# Altium project eBug2014-Parallella-Carrier-V.PrjPcb
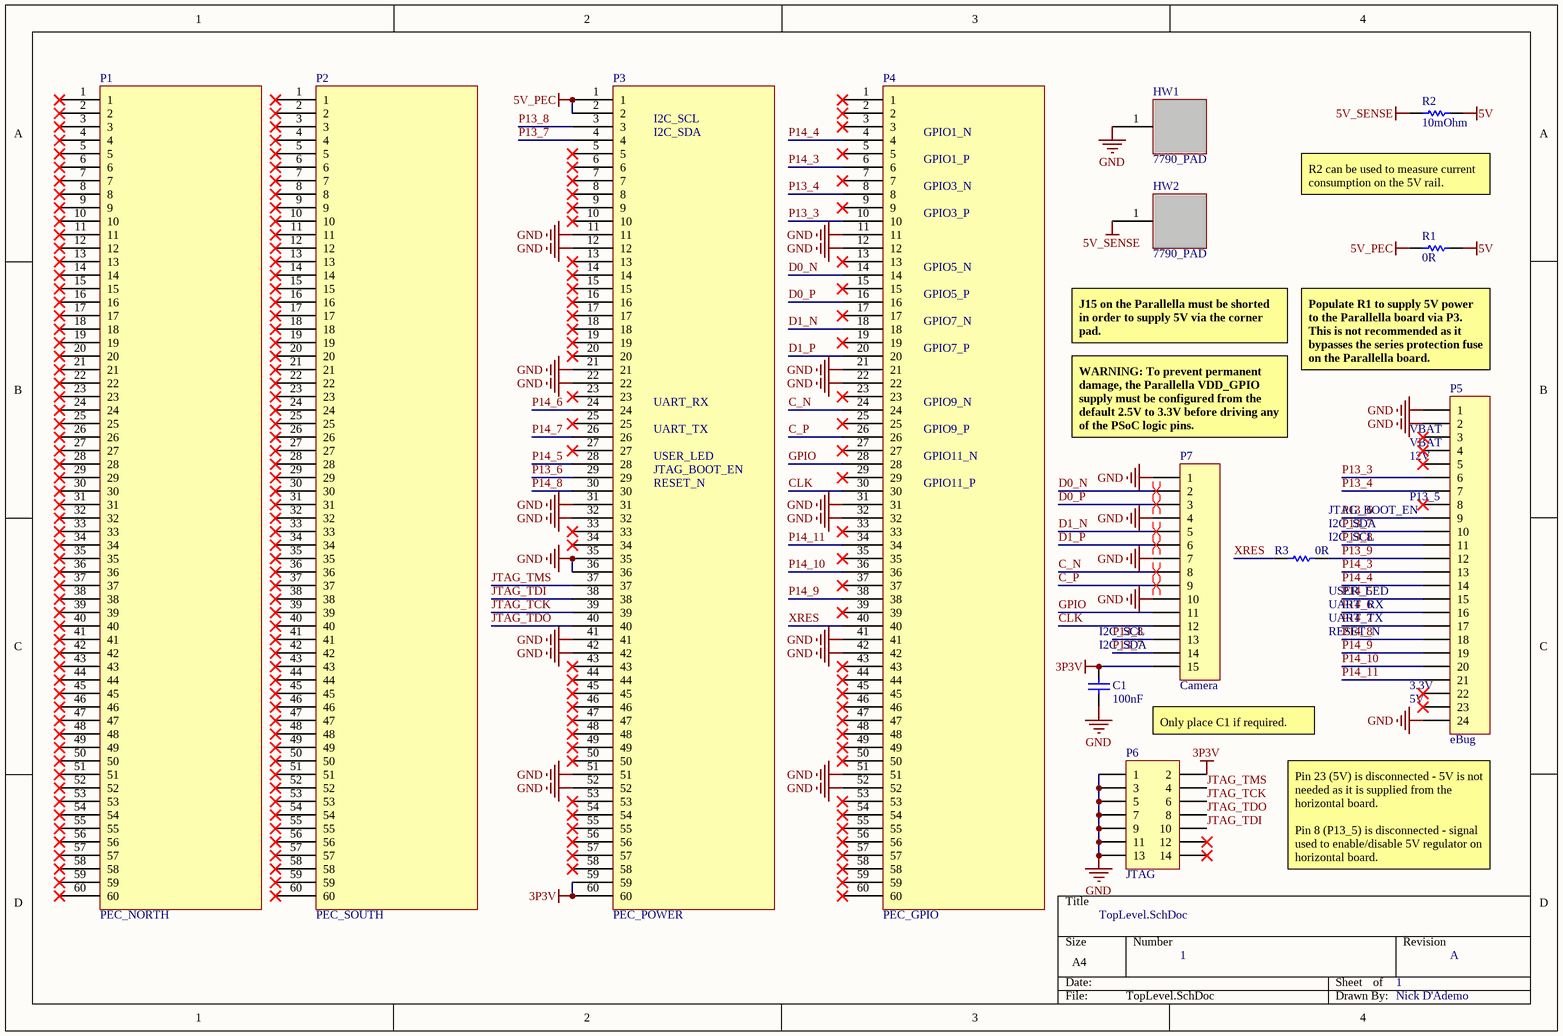
[diagram p0: TopLevel.SchDoc]
1 sheet, 13 parts. Net scope: global (net labels, ports and power ports of the same name join across sheets).
Board file: PCB.PcbDoc

## Sheet TopLevel.SchDoc
size A4; DrawnBy: Nick D'Ademo; DocumentNumber: 1; Revision: A; SheetNumber: 1; SheetTotal: 1

### Parts
C1  value 100nF  [CAPC1005N]  (hidden comment: Cap)
HW1  7790_PAD  [7790_PAD]  (no BOM)
HW2  7790_PAD  [7790_PAD]  (no BOM)
P1  PEC_NORTH  [BTH-030-01-F-D-A]
P2  PEC_SOUTH  [BTH-030-01-F-D-A]
P3  PEC_POWER  [BTH-030-01-F-D-A]
P4  PEC_GPIO  [BTH-030-01-F-D-A]
P5  eBug  [2-1734592-4_MIRRORED]
P6  JTAG  [2x7H_2mm]
P7  Camera  [1-1734248-5]
R1  value 0R  [RESC1608M]  (hidden comment: Jumper Resistor)
R2  value 10mOhm  [RESC6432M]  (hidden comment: Current Sense Resistor)
R3  value 0R  [RESC1608M]  (hidden comment: Jumper Resistor)

### Nets
3P3V: C1.2 P3.59 P3.60 P6.2 P7.15
5V: R1.1 R2.1
5V_PEC: P3.1 P3.2 R1.2
5V_SENSE: HW2.1 R2.2
GND: C1.1 HW1.1 P3.11 P3.12 P3.21 P3.22 P3.31 P3.32 P3.35 P3.36 P3.41 P3.42 P3.51 P3.52 P4.11 P4.12 P4.21 P4.22 P4.31 P4.32 P4.41 P4.42 P4.51 P4.52 P5.1 P5.2 P5.24 P6.1 P6.3 P6.5 P6.7 P6.9 P6.11 P6.13 P7.1 P7.4 P7.7 P7.10
C_N: P4.24 P7.8
C_P: P4.26 P7.9
CLK: P4.30 P7.12
D0_N: P4.14 P7.2
D0_P: P4.16 P7.3
D1_N: P4.18 P7.5
D1_P: P4.20 P7.6
GPIO: P4.28 P7.11
JTAG_TCK: P3.39 P6.6
JTAG_TDI: P3.38 P6.10
JTAG_TDO: P3.40 P6.8
JTAG_TMS: P3.37 P6.4
P13_3: P4.10 P5.6
P13_4: P4.8 P5.7
P13_6: P3.29 P5.9
P13_7: P3.4 P5.10 P7.14
P13_8: P3.3 P5.11 P7.13
P13_9: P5.12 R3.1
P14_3: P4.6 P5.13
P14_4: P4.4 P5.14
P14_5: P3.28 P5.15
P14_6: P3.24 P5.16
P14_7: P3.26 P5.17
P14_8: P3.30 P5.18
P14_9: P4.38 P5.19
P14_10: P4.36 P5.20
P14_11: P4.34 P5.21
XRES: P4.40 R3.2

Not connected (* = marked no-connect by the designer): P1 1* 2* 3* 4* 5* 6* 7* 8* 9* 10* 11* 12* 13* 14* 15* 16* 17* 18* 19* 20* 21* 22* 23* 24* 25* 26* 27* 28* 29* 30* 31* 32* 33* 34* 35* 36* 37* 38* 39* 40* 41* 42* 43* 44* 45* 46* 47* 48* 49* 50* 51* 52* 53* 54* 55* 56* 57* 58* 59* 60*; P2 1* 2* 3* 4* 5* 6* 7* 8* 9* 10* 11* 12* 13* 14* 15* 16* 17* 18* 19* 20* 21* 22* 23* 24* 25* 26* 27* 28* 29* 30* 31* 32* 33* 34* 35* 36* 37* 38* 39* 40* 41* 42* 43* 44* 45* 46* 47* 48* 49* 50* 51* 52* 53* 54* 55* 56* 57* 58* 59* 60*; P3 5* 6* 7* 8* 9* 10* 13* 14* 15* 16* 17* 18* 19* 20* 23* 25* 27* 33* 34* 43* 44* 45* 46* 47* 48* 49* 50* 53* 54* 55* 56* 57* 58*; P4 1* 2* 3* 5* 7* 9* 13* 15* 17* 19* 23* 25* 27* 29* 33* 35* 37* 39* 43* 44* 45* 46* 47* 48* 49* 50* 53* 54* 55* 56* 57* 58* 59* 60*; P5 3* 4* 5* 8* 22* 23*; P6 12* 14*

### Layout directives
differential pair: C_N, C_P, D0_N, D0_P, D1_N, D1_P

### Notes on the sheet
- (near P3) I2C_SDA
- (near P3) I2C_SCL
- (near P4) GPIO1_N
- (near P4) GPIO1_P
- (near P4) GPIO3_N
- (near P4) GPIO3_P
- R2 can be used to measure current consumption on the 5V rail.
- (near P4) GPIO5_N
- (near P4) GPIO5_P
- (near P4) GPIO7_N
- (near P4) GPIO7_P
- J15 on the Parallella must be shorted in order to supply 5V via the corner pad.
- Populate R1 to supply 5V power to the Parallella board via P3. This is not recommended as it bypasses the series protection fuse on the Parallella board.
- (near P3) UART_RX
- (near P3) UART_TX
- (near P4) GPIO9_N
- (near P4) GPIO9_P
- (near P7) WARNING: To prevent permanent damage, the Parallella VDD_GPIO supply must be configured from the default 2.5V to 3.3V before driving any of the PSoC logic pins.
- (near P5) VBAT
- (near P3) USER_LED
- (near P3) JTAG_BOOT_EN
- (near P3) RESET_N
- (near P4) GPIO11_N
- (near P4) GPIO11_P
- (near R3) JTAG_BOOT_EN
- (near P5) 12V
- (near P5) P13_5
- (near R3) I2C_SDA
- (near R3) I2C_SCL
- (near C1) I2C_SDA
- (near C1) I2C_SCL
- (near R3) UART_RX
- UART_TX
- (near R3) USER_LED
- RESET_N
- (near P5) 3.3V
- (near P5) 5V
- Only place C1 if required.
- (near P5) Pin 23 (5V) is disconnected - 5V is not needed as it is supplied from the horizontal board.
  Pin 8 (P13_5) is disconnected - signal used to enable/disable 5V regulator on horizontal board.

### Library data of the parts
C1 = Cap: Capacitor, X7R, ±10%, 16V, 0402; Published: 8-Jun-2000; LatestRevisionDate: 17-Jul-2002; LatestRevisionNote: Re-released for DXP Platform.; PackageReference: RAD-0.3; Publisher: Altium Limited; PackageDescription: Radial Cap, Thru-Hole; 2 Leads; 0.3 in Pin Spacing
P1-P4 = BTH-030-01-F-D-A: SAMTEC - BTH-030-01-F-D-A - Conn Micro Terminal HDR 60 POS 0.5mm
P5 = Header 24: TE CONNECTIVITY - 2-1734592-4 - CONN FPC BOTTOM 24POS 0.50MM R/A; LatestRevisionDate: 17-Jul-2002; LatestRevisionNote: Re-released for DXP Platform.; Publisher: Altium Limited
P6 = Header 7X2: Header, 7-Pin, Dual row; LatestRevisionDate: 17-Jul-2002; LatestRevisionNote: Re-released for DXP Platform.; Publisher: Altium Limited
P7 = Header 15: TE CONNECTIVITY - 1-1734248-5 - 15 Position FPC Connector Contacts, Vertical, 1 Sided 0.039" (1.00mm) Surface Mount; LatestRevisionDate: 17-Jul-2002; LatestRevisionNote: Re-released for DXP Platform.; Publisher: Altium Limited
R1 R3 = Res1: Resistor, ±1%, 0.1W, 0603; Published: 8-Jun-2000; LatestRevisionDate: 17-Jul-2002; LatestRevisionNote: Re-released for DXP Platform.; PackageReference: AXIAL-0.3; Publisher: Altium Limited; PackageDescription: Axial Device, Thru-Hole; 2 Leads; 0.3 in Pin Spacing
R2 = Res1: BOURNS - CRL2512-FU-R010ELF - Surface Mount Thick Film Resistor, CRL Series, 0.01 ohm, 1 W, ± 1%, 2512 [6432 Metric]; Published: 8-Jun-2000; LatestRevisionDate: 17-Jul-2002; LatestRevisionNote: Re-released for DXP Platform.; PackageReference: AXIAL-0.3; Publisher: Altium Limited; PackageDescription: Axial Device, Thru-Hole; 2 Leads; 0.3 in Pin Spacing